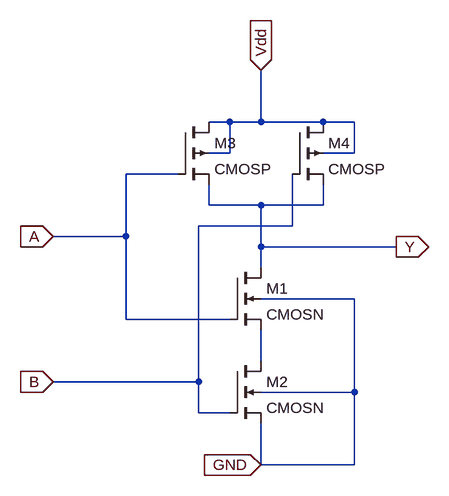
[diagram p0: schematic cmos_NAND.asc]
cmos_NAND.asc, the LTspice schematic file:
Version 4
SHEET 1 880 680
WIRE 224 -144 192 -144
WIRE 272 -144 272 -224
WIRE 272 -144 224 -144
WIRE 368 -144 272 -144
WIRE 416 -144 368 -144
WIRE 224 -96 224 -144
WIRE 224 -96 192 -96
WIRE 416 -96 416 -144
WIRE 416 -96 368 -96
WIRE 144 -64 64 -64
WIRE 192 -16 192 -48
WIRE 272 -16 192 -16
WIRE 368 -16 368 -48
WIRE 368 -16 272 -16
WIRE 320 16 320 -64
WIRE 320 16 176 16
WIRE 64 32 64 -64
WIRE 64 32 -48 32
WIRE 272 48 272 -16
WIRE 480 48 272 48
WIRE 272 80 272 48
WIRE 416 128 272 128
WIRE 64 160 64 32
WIRE 224 160 64 160
WIRE 272 224 272 176
WIRE 176 256 176 16
WIRE 176 256 -48 256
WIRE 416 272 416 128
WIRE 416 272 272 272
WIRE 176 304 176 256
WIRE 224 304 176 304
WIRE 272 384 272 320
WIRE 416 384 416 272
WIRE 416 384 272 384
FLAG 480 48 Y
IOPIN 480 48 Out
FLAG -48 32 A
IOPIN -48 32 In
FLAG -48 256 B
IOPIN -48 256 In
FLAG 272 -224 Vdd
IOPIN 272 -224 In
FLAG 272 384 GND
IOPIN 272 384 In
SYMBOL cmosn 224 80 R0
SYMATTR InstName M1
SYMBOL cmosn 224 224 R0
SYMATTR InstName M2
SYMBOL cmosp 144 -144 R0
SYMATTR InstName M3
SYMBOL cmosp 320 -144 R0
SYMATTR InstName M4

The netlist it stands for:
* cmos_NAND.asc
M1 Y A N001 GND CMOSN
M2 N001 B GND GND CMOSN
M3 Vdd A Y Vdd CMOSP
M4 Vdd B Y Vdd CMOSP
.model NMOS NMOS
.model PMOS PMOS
.lib standard.mos
.backanno
.end